# EAGLE schematic LED_Panel_And_Driver (EAGLE 9.6.2)
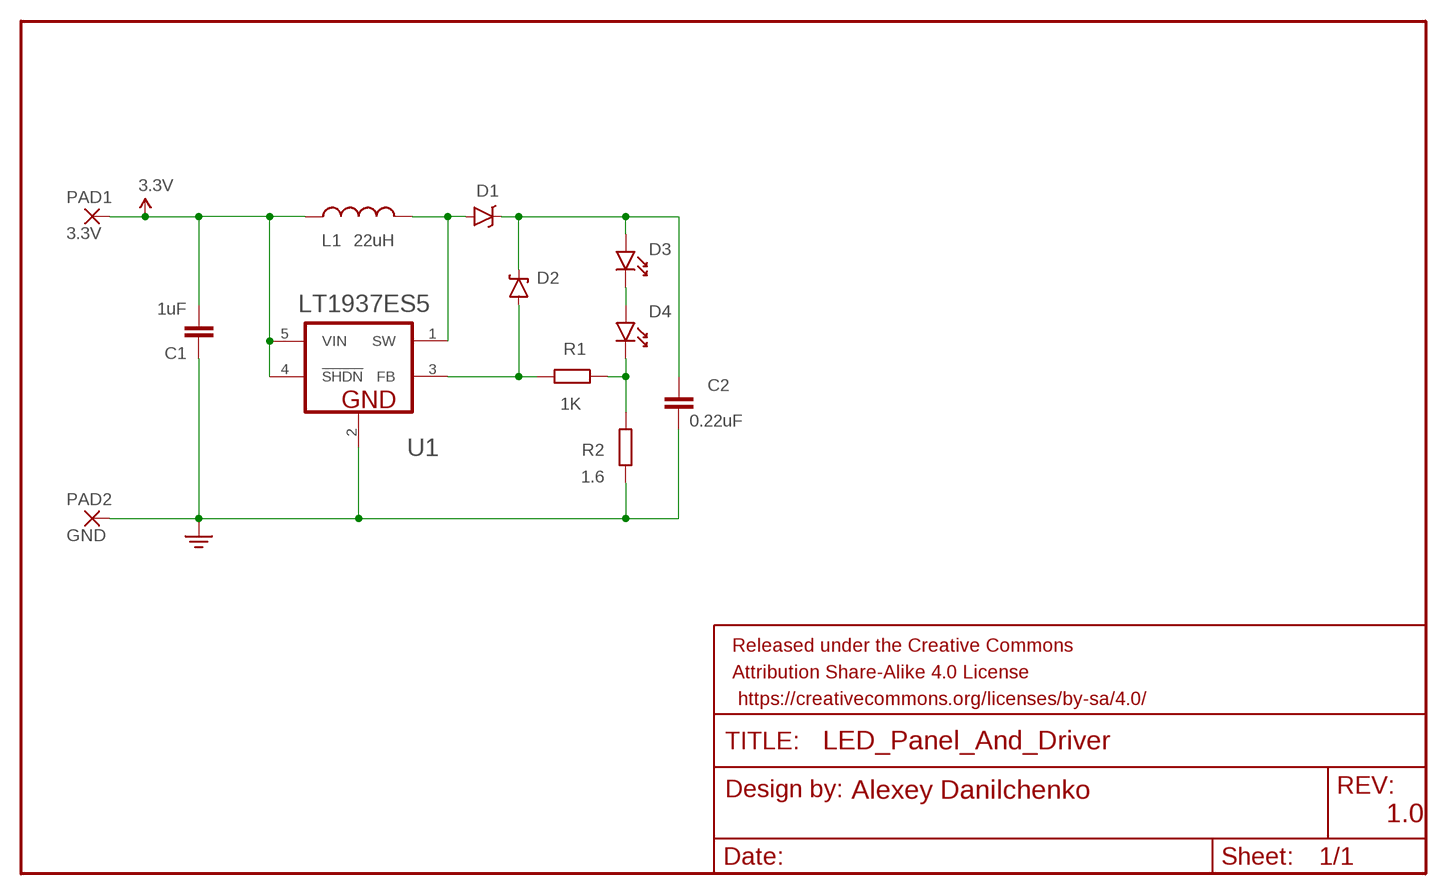
[diagram p0: schematic, sheet 1]

## Parts
C1  1uF  C-EUC0805  [C0805]
C2  0.22uF  CAP0603-CAP  [0603-CAP]
D1  RB751  DIODE-SCHOTTKY-RB751  [SOD-523]
D2  DIODE-ZENER  [SOD-923]
D3  YUJI_2835_SMD  [2835_SMD]
D4  YUJI_2835_SMD  [2835_SMD]
FRAME1  FRAME-LEDGER  [CREATIVE_COMMONS]
L1  22uH  INDUCTOR1210  [1210]
PAD1  3.3V  SMD5  [SMD2,54-5,08]
PAD2  GND  SMD5  [SMD2,54-5,08]
R1  1K  R-EU_R0805  [R0805]
R2  1.6  R-EU_M1206  [M1206]
U1  LT1937ES5  LINEAR_TECHNOLOGY_LT1937ES5#TRMPBFLINEAR_TECHNOLOGY_LT1937ES5#TRMPBF_0_1  [LINEAR_TECHNOLOGY_LT1937ES5#TRMPBF_1]

## Nets
3.3V: C1.1 L1.1 PAD1.1(P) U1.4(!SHDN!) U1.5(VIN)
GND: C1.2 C2.2 PAD2.1(P) R2.1 U1.2(GND)
N$1: D1.A L1.2 U1.1(SW)
N$2: D2.A R1.2 U1.3(FB)
N$5: D3.CATHODE D4.ANODE
N$6: D4.CATHODE R1.1 R2.2
N$7: C2.1 D1.C D2.C D3.ANODE

## Library data of the parts
C1 = rcl:C-EU: CAPACITOR, European symbol
C2 = SparkFun-Passives:CAP: Capacitor Standard 0603 ceramic capacitor, and 0.1" leaded capacitor.
D1 = SparkFun-DiscreteSemi:DIODE-SCHOTTKY: Schottky diodes in SFE's production catalog BAT20J 1A 23V 0.62Vf RB751 120mA 40V 0.37Vf PMEG4005EJ 0.5A 40V 0.42Vf MBRA140 1A 40V 0.5Vf B340A 3A 40V SMA; PROD_ID: DIO-11018
D2 = SparkFun-DiscreteSemi:DIODE-ZENER: Zener Diode Production Part - 8199 3.4V Zener Voltage
D3 D4 = Yuji_LED:YUJI_2835_SMD
FRAME1 = SparkFun-Aesthetics:FRAME-LEDGER: Schematic Frame Standard 11x14 US Ledger frame; AUTHOR: Alexey Danilchenko; VER: 1.0
L1 = SparkFun-Passives:INDUCTOR: Inductors Basic Inductor/Choke - 0603 and 1206. Footprints are not proven and vary greatly between part numbers. INDUCTOR POWER 3.3UH 4.0A SMD 0.197" L x 0.197" W x 0.177" H (5.00mm x 5.00mm x 4.50mm)
PAD1 PAD2 = wirepad:SMD5: SMD PAD
R1 = Spectron2:R-EU_: RESISTOR, European symbol
R2 = rcl:R-EU_: RESISTOR, European symbol; SPICEPREFIX: R
U1 = LT1937ES5:LINEAR_TECHNOLOGY_LT1937ES5#TRMPBF: LT-LT1937-S5-5; CIIVA_IDS: 1159927; CODE__JEDEC: MO-193; COMPONENT_LINK_1_DESCRIPTION: Manufacturer URL; COMPONENT_LINK_1_URL: http://www.linear.com/; COMPONENT_LINK_3_DESCRIPTION: Package Specification; COMPONENT_LINK_3_URL: http://cds.linear.com/docs/en/packaging/SOT_5_05-08-1635.pdf; DATASHEET: http://cds.linear.com/docs/en/datasheet/1937f.pdf; FOOTPRINT_VARIANT_NAME_0: Level C; FOOTPRINT_VARIANT_NAME_1: Level B; FOOTPRINT_VARIANT_NAME_2: Level A; IMPORTED: yes; IMPORTED_FROM: vault; IMPORT_TS: 1521849081; MF: Linear Technology; MOUNTING_TECHNOLOGY: Surface Mount; MPN: LT1937ES5#TRMPBF; PACKAGE: S5-5; PACKAGE_DESCRIPTION: 5-Pin Plastic TSOT-23, Body 1.63 x 2.90 mm, Pitch 0.95 mm; PACKAGE_VERSION: Jun-10; PACKING: Mini Tape and Reel; PREFIX: U; RELEASE_DATE: 1377826763; ROHS: Yes; TOPOLOGY: Boost, LED Driver; VAULT_GUID: 5DE084F1-2912-492B-B132-4CB47614E220; VAULT_REVISION: A53C5704-23FA-4F88-86CB-19E9C1DD8ED3; VIN_MINV: 2.5